# EAGLE design velocimetro3 (EAGLE 5.10)
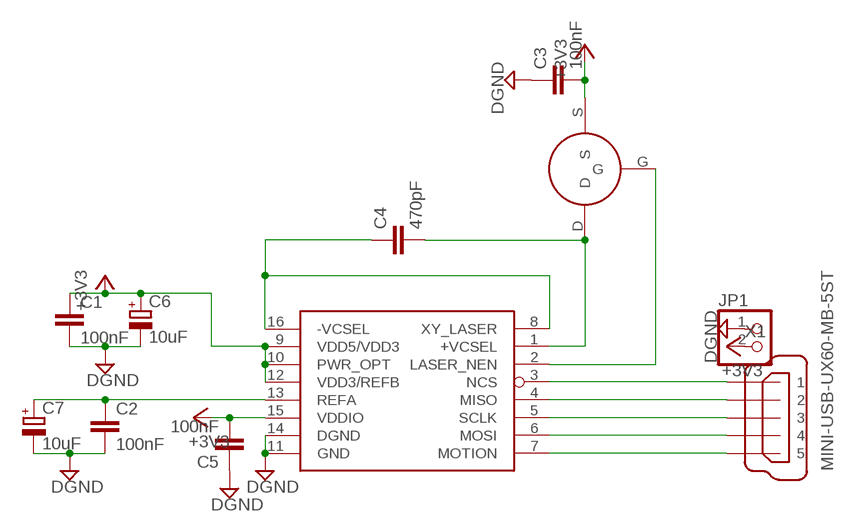
[diagram p0: schematic, sheet 1]

## Parts
C1  100nF  C-EUC0603  [C0603]
C2  100nF  C-EUC0603  [C0603]
C3  100nF  C-EUC0603  [C0603]
C4  470pF  C-EUC0603  [C0603]
C5  100nF  C-EUC0603  [C0603]
C6  10uF  CPOL-EU153CLV-0405  [153CLV-0405]
C7  10uF  CPOL-EU153CLV-0405  [153CLV-0405]
JP1  PINHD-1X2  [1X02]
U$1  ADNS-9500  [ADNS-9500]
U$2  NTA4151P  [SOT416]
X1  MINI-USB-UX60-MB-5ST  [UX60-MB-5ST]

## Nets
+3V3: C1.1 C3.2 C5.2 C6.+ JP1.2 U$1.9(VDD5/VDD3) U$1.10(PWR_OPT) U$1.12(VDD3/REFB) U$1.15(VDDIO) U$2.S
DGND: C1.2 C2.2 C3.1 C5.1 C6.- C7.- JP1.1 U$1.11(GND) U$1.14(DGND)
N$1: C2.1 C7.+ U$1.13(REFA)
N$2: U$1.3(NCS) X1.1
N$3: U$1.4(MISO) X1.2
N$4: U$1.5(SCLK) X1.3
N$5: U$1.6(MOSI) X1.4
N$6: C4.1 U$1.8(XY_LASER) U$1.16(-VCSEL)
N$7: C4.2 U$1.1(+VCSEL) U$2.D
N$8: U$1.7(MOTION) X1.5
N$10: U$1.2(LASER_NEN) U$2.G

## Library data of the parts
C1-C5 = resistor:C-EU: CAPACITOR, European symbol
C6 C7 = resistor:CPOL-EU: POLARIZED CAPACITOR, European symbol
JP1 = pinhead:PINHD-1X2: PIN HEADER
U$1 = mouse:ADNS-9500: Avago Mouse sensor, 150 ips adns-9500; ADNS-9500: mouse sensor
U$2 = mouse:NTA4151P
X1 = con-hirose:MINI-USB-: MINI USB Connector Source: http://www.hirose.co.jp/cataloge_hp/e24000019.pdf

## Board
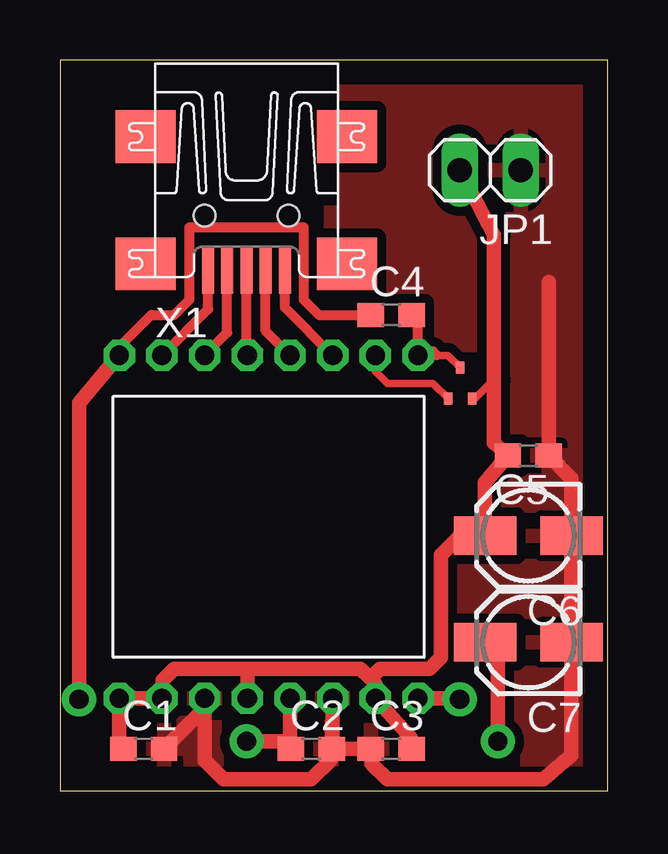
[diagram p1: board, top side]
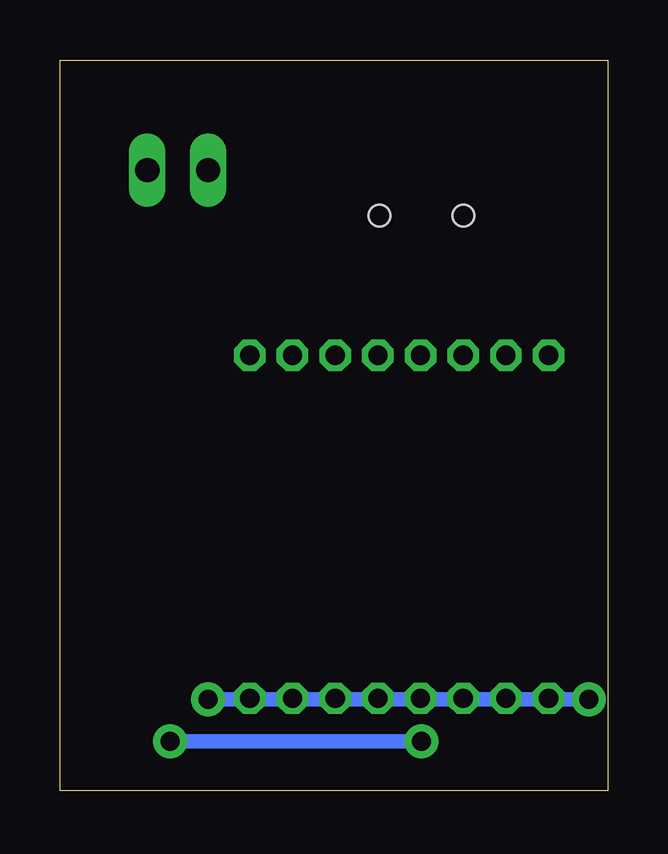
[diagram p2: board, bottom side, seen from below]

Size 22.85 x 30.47 mm. Coordinates in mm from the lower left corner, seen from the top.
Outline: 0,0 22.85,0 22.85,30.47 0,30.47 0,0
Copper layers (1*16): Top 0.035mm / dielectric 1.5mm / Bottom 0.035mm
Design rules "default *": minimum track width 10mil, minimum drill 24mil, track to track 15mil, track to pad 15mil, pad to pad 15mil, via to via 15mil, smd to smd 15mil, copper to edge 40mil, drill to drill 8mil, minimum pad ring 10mil, minimum via ring 8mil, stop-mask expansion 4mil, vias tented up to drill 0mil, thermal gap 10mil

### Footprints (pad centres in the part's own frame; a part is rotated, then mirrored left to right if it is on the bottom)
C0603 = smd 1.1 x 1: 1 -0.85,0; 2 0.85,0
153CLV-0405 = smd 2.6 x 1.6: + 1.8,0; - -1.8,0
1X02 = drill 1.016 long: 1 -1.27,0; 2 1.27,0
ADNS-9500 = drill 0.8 octagon: 1 12.71,12.6; 2 10.93,12.6; 3 9.15,12.6; 4 7.37,12.6; 5 5.59,12.6; 6 3.81,12.6; 7 2.03,12.6; 8 0.25,12.6; 9 0.25,-1.7; 10 2.03,-1.7; 11 3.81,-1.7; 12 5.59,-1.7; 13 7.37,-1.7; 14 9.15,-1.7; 15 10.93,-1.7; 16 12.71,-1.7
SOT416 = smd 0.356 x 0.508: D 0.5,1.295; G 0,0; S 1,0
UX60-MB-5ST = smd 2 x 0.5: 1 2.25,1.6; 2 2.25,0.8; 3 2.25,0; 4 2.25,-0.8; 5 2.25,-1.6 | smd 2.2 x 2.5: M1 -3.3,-4.2; M2 -3.3,4.2; M3 2,4.2; M4 2,-4.2 | hole 0.9: 0,-1.75; 0,1.75

### Placement (x,y rotation side)
C1  3.49,1.75 0 top
C2  10.48,1.75 0 top
C3  13.81,1.75 0 top
C4  13.81,19.84 0 top
C5  19.53,13.97 180 top
C6  19.53,10.64 180 top
C7  19.53,6.19 180 top
JP1  17.94,25.88 180 top
U$1  2.22,5.56 0 top
U$2  16.19,16.35 0 top
X1  7.78,23.97 270 top

### Tracks (layer width: path | path; a pad name or v marks a point on that pad's centre or on a via)
+3V3
  Top 0.305: U$2.S 17.3,16.35 18.1,17.14
  Top 0.61: C1.1 2.47,1.92 U$1.9 U$1.10 4.29,4.53 4.29,4.6 4.76,5.08 7.81,5.08 | 12.94,4.68 12.54,5.08 7.81,5.08 | 12.94,4.68 13.15,4.47 U$1.15 14.61,2.22 C3.2 | 7.81,5.08 U$1.12 | 12.94,4.68 13.34,5.08 15.4,5.08 15.88,5.56 15.88,9.84 16.67,10.64 C6.+ 17.73,12.86 C5.2 18.1,14.5 18.1,17.14 18.1,23.18 JP1.2
DGND
  Top 0.61: C1.2 6.03,3.44 U$1.11 6.03,1.27 6.83,0.48 10.48,0.48 11.27,1.27 11.27,1.69 C2.2 | U$1.14 11.37,1.79 C2.2 | C2.2 C3.1 13.02,1.69 13.02,1.11 13.65,0.48 20.16,0.48 21.33,1.48 C7.- C6.- 21.33,13.02 C5.1 20.38,21.22
  pour Top: 0,30.48 22.86,30.48 22.86,0 0,0
N$1  (via drill 0.8 pad 1.42)
  Top 0.61: U$1.13 9.59,1.78 C2.1 9.31,2.06 v7.78,2.06 | C7.+ 18.26,6.25 v18.26,2.06
  Bottom 0.61: v7.78,2.06 v18.26,2.06
N$2
  Top 0.406: X1.1 9.38,20.15 U$1.3
N$3
  Top 0.406: X1.2 8.58,19.17 U$1.4
N$4
  Top 0.406: X1.3 7.78,18.19 U$1.5
N$5
  Top 0.406: X1.4 6.98,19.1 U$1.6
N$6  (via drill 0.8 pad 1.42)
  Top 0.406: C4.1 10.79,19.84 10.16,20.48 10.16,23.5 5.4,23.5 5.4,20.48 4.76,19.84 3.81,19.84 2.47,18.51 U$1.8
  Top 0.61: U$1.8 2.14,17.76 0.79,16.16 v0.79,3.81 | v16.67,3.81 16.62,3.86 U$1.16
  Bottom 0.61: v0.79,3.81 v16.67,3.81
N$7
  Top 0.305: U$1.1 15.72,18.16 16.18,18.16 U$2.D
  Top 0.406: 15.72,18.16 15.56,18.32 | U$1.1 14.93,19.46 C4.2
N$8
  Top 0.406: X1.5 6.18,20.08 U$1.7
N$10
  Top 0.305: U$1.2 13.15,17.49 13.65,16.99 15.56,16.99 U$2.G